# Altium schematic sheet HeatControl.SchDoc
size B
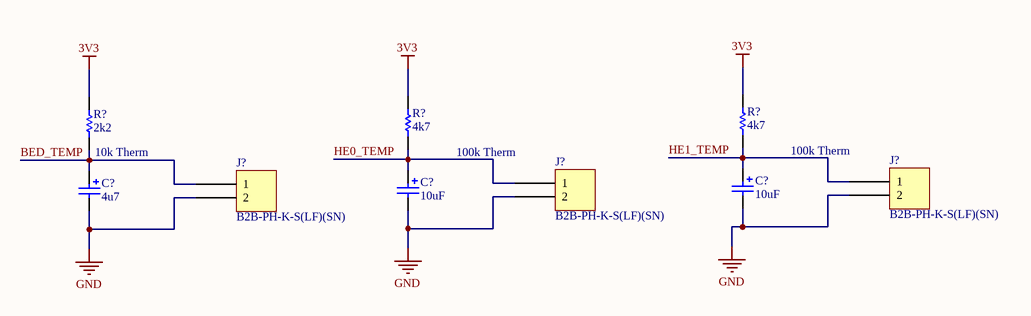
[diagram p0: HeatControl.SchDoc]

## Parts
(Parts that share a designator on the sheet are numbered #1, #2 ... from top to bottom, then left to right.)
C?#1  4u7  [TAN-B]
C?#2  10uF  [TAN-B]
C?#3  10uF  [TAN-B]
J?#1  B2B-PH-K-S(LF)(SN)  [JST B2B-PH-K]
J?#2  B2B-PH-K-S(LF)(SN)  [JST B2B-PH-K]
J?#3  B2B-PH-K-S(LF)(SN)  [JST B2B-PH-K]
R?#1  value 2k2  [AXIAL-0.3]  (hidden comment: Res1)
R?#2  value 4k7  [AXIAL-0.3]  (hidden comment: Res1)
R?#3  value 4k7  [AXIAL-0.3]  (hidden comment: Res1)

## Nets
3V3: R?#1.1 R?#2.1 R?#3.1
GND: C?#1.2 C?#2.2 C?#3.2 J?#1.2 J?#2.2 J?#3.2
BED_TEMP: C?#1.1 J?#1.1 R?#1.2
HE0_TEMP: C?#2.1 J?#2.1 R?#2.2
HE1_TEMP: C?#3.1 J?#3.1 R?#3.2

## Notes on the sheet
- (near R?#1) 10k Therm
- 100k Therm

## Library data of the parts
C?#1 = Cap Pol1: Polarized Capacitor (Radial); Value: 10uF; Published: 8-Jun-2000; Revision: July-2002: Re-released for DXP Platform.; Publisher: Altium Limited
C?#2 C?#3 = Cap Pol1: Polarized Capacitor (Radial); Published: 8-Jun-2000; Revision: July-2002: Re-released for DXP Platform.; Publisher: Altium Limited; Value: 10uF
J?#1-J?#3 = B2B-PH-K-S(LF)(SN): CONN HEADER VERT 2POS 2MM; Manufacturer: JST Sales America Inc.; Contact Length - Mating: 0.130" (3.30mm); Contact Length - Post: 0.134" (3.40mm); Current Rating (Amps): 2A; Material Flammability Rating: UL94 V-0; Number of Positions: 2; Number of Positions Loaded: All; Overall Contact Length: 0.333" (8.45mm); Pitch - Mating: 0.079" (2.00mm); Shrouding: Shrouded - 4 Wall; Style: Board to Cable/Wire; Voltage Rating: 100V; Part Number: B2B-PH-K-S(LF)(SN); ComponentLink1Description: Datasheet; ComponentLink1URL: http://www.jst-mfg.com/product/pdf/eng/ePH.pdf; ComponentLink2Description: DigiKey Link; ComponentLink2URL: http://digikey.com/product-detail/en/jst-sales-america-inc/B2B-PH-K-S-LF-SN/455-1704-ND/926611; Connector Type: Header; Contact Finish - Mating: Tin; Contact Finish - Post: Tin; Contact Material: Brass; Contact Shape: Square; Contact Type: Male Pin; Fastening Type: Detent Lock; Insulation Color: Natural; Insulation Height: 0.236" (6.00mm); Insulation Material: Polyamide (PA66), Nylon 6/6; LastUpdated: 1/3/2020 11:40:58 PM; Lifecycle Status: Active; Minimum Order: 1; Mounting Type: Through Hole; Number of Rows: 1; Operating Temperature: -25°C ~ 85°C; Packaging: Bulk; PartId: 11; Part Status: Active; Price: 0.17; Series: PH; Supplier 1: DigiKey; Supplier Part Number 1: 455-1704-ND; Termination: Press-Fit, Solder
R?#1-R?#3 = Res1: Resistor; Published: 8-Jun-2000; LatestRevisionDate: 17-Jul-2002; LatestRevisionNote: Re-released for DXP Platform.; PackageReference: AXIAL-0.3; Publisher: Altium Limited; PackageDescription: Axial Device, Thru-Hole; 2 Leads; 0.3 in Pin Spacing